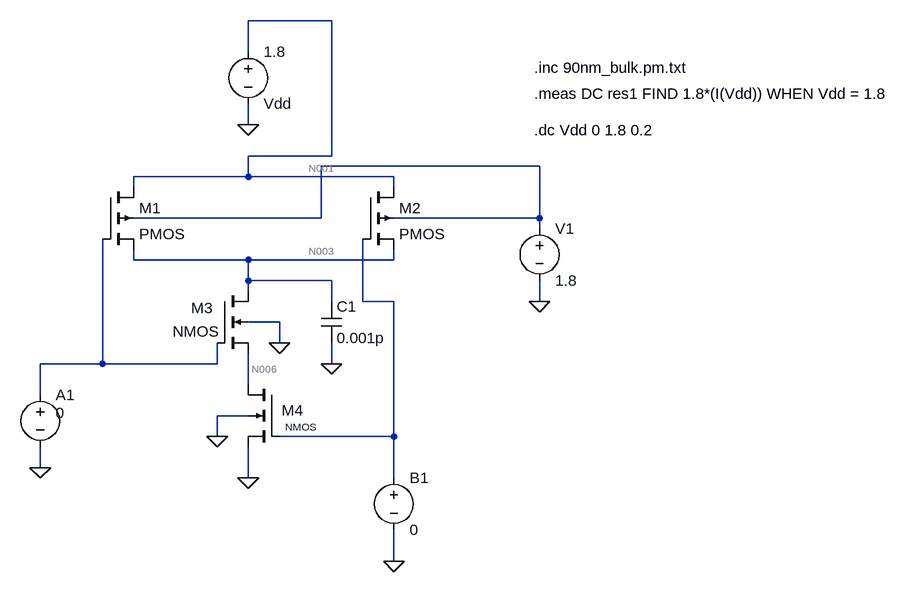
[diagram p0: schematic Draft1.asc]
Draft1.asc, the LTspice schematic file:
Version 4
SHEET 1 1124 680
WIRE 192 -608 64 -608
WIRE 64 -560 64 -608
WIRE 64 -448 64 -480
WIRE 192 -400 192 -608
WIRE 192 -400 64 -400
WIRE 512 -384 176 -384
WIRE 64 -368 64 -400
WIRE 64 -368 -112 -368
WIRE 288 -368 64 -368
WIRE -112 -352 -112 -368
WIRE 288 -352 288 -368
WIRE 176 -304 176 -384
WIRE 176 -304 -112 -304
WIRE 512 -304 512 -384
WIRE 512 -304 288 -304
WIRE 512 -288 512 -304
WIRE -112 -240 -112 -256
WIRE 64 -240 -112 -240
WIRE 288 -240 288 -256
WIRE 288 -240 64 -240
WIRE 64 -208 64 -240
WIRE 192 -208 64 -208
WIRE 64 -192 64 -208
WIRE 192 -176 192 -208
WIRE 240 -176 240 -272
WIRE 288 -176 240 -176
WIRE 512 -176 512 -208
WIRE 112 -144 64 -144
WIRE 112 -112 112 -144
WIRE -160 -80 -160 -272
WIRE -160 -80 -256 -80
WIRE 16 -80 16 -112
WIRE 16 -80 -160 -80
WIRE 192 -80 192 -112
WIRE 64 -48 64 -96
WIRE -256 -32 -256 -80
WIRE 64 0 16 0
WIRE 16 32 16 0
WIRE 288 32 288 -176
WIRE 288 32 112 32
WIRE -256 80 -256 48
WIRE 64 96 64 48
WIRE 288 96 288 32
WIRE 288 224 288 176
FLAG 192 -80 0
FLAG 64 -448 0
FLAG 112 -112 0
FLAG 64 96 0
FLAG 288 224 0
FLAG 16 32 0
FLAG -256 80 0
FLAG 512 -176 0
SYMBOL voltage 64 -576 R0
WINDOW 0 24 96 Left 2
WINDOW 3 24 16 Left 2
WINDOW 123 0 0 Left 0
WINDOW 39 0 0 Left 0
SYMATTR InstName Vdd
SYMATTR Value 1.8
SYMBOL pmos4 -160 -352 R0
SYMATTR InstName M1
SYMATTR Value2 l=90n w=400n
SYMBOL pmos4 240 -352 R0
SYMATTR InstName M2
SYMATTR Value2 l=90n w=400n
SYMBOL nmos4 16 -192 R0
WINDOW 0 -40 26 Left 2
WINDOW 3 -68 62 Left 2
SYMATTR InstName M3
SYMATTR Value2 l=90n w=100n
SYMBOL nmos4 112 -48 M0
WINDOW 0 -20 40 Center 2
WINDOW 3 -33 55 Top 1
SYMATTR InstName M4
SYMATTR Value2 l=90n w=100n
SYMBOL cap 176 -176 R0
SYMATTR InstName C1
SYMATTR Value 0.001p
SYMBOL voltage 288 80 R0
WINDOW 123 0 0 Left 0
WINDOW 39 0 0 Left 0
SYMATTR InstName B1
SYMATTR Value 0
SYMBOL voltage -256 -48 R0
WINDOW 3 24 44 Left 2
WINDOW 123 0 0 Left 0
WINDOW 39 0 0 Left 0
SYMATTR InstName A1
SYMATTR Value 0
SYMBOL voltage 512 -304 R0
WINDOW 123 0 0 Left 0
WINDOW 39 0 0 Left 0
SYMATTR InstName V1
SYMATTR Value 1.8
TEXT 504 -536 Left 2 !.inc 90nm_bulk.pm.txt
TEXT 504 -496 Left 2 !.meas DC res1 FIND 1.8*(I(Vdd)) WHEN Vdd = 1.8
TEXT 504 -440 Left 2 !.dc Vdd 0 1.8 0.2

The netlist it stands for:
* Draft1.asc
Vdd N001 0 1.8
M1 N001 N005 N003 N002 PMOS l=90n w=400n
M2 N001 N004 N003 N002 PMOS l=90n w=400n
M3 N003 N005 N006 0 NMOS l=90n w=100n
M4 N006 N004 0 0 NMOS l=90n w=100n
C1 N003 0 0.001p
V§B1 N004 0 0
V§A1 N005 0 0
V1 N002 0 1.8
.model NMOS NMOS
.model PMOS PMOS
.lib standard.mos
.inc 90nm_bulk.pm.txt
.meas DC res1 FIND 1.8*(I(Vdd)) WHEN Vdd = 1.8
.dc Vdd 0 1.8 0.2
.backanno
.end

* Results of the author's LTspice run, read from the files saved beside the schematic
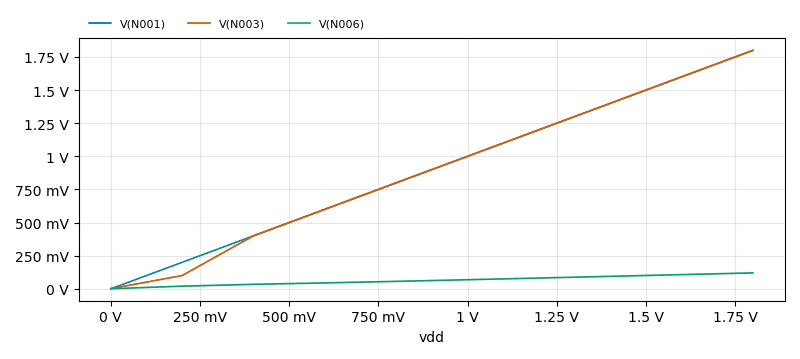
[diagram p1: DC transfer characteristic of Draft1.asc, plotted from the saved traces]
* DC transfer characteristic, 1 run:
*   V(N001): 0 V at vdd=0 V, 1.8 V at vdd=1.8 V, min 0 V, max 1.8 V
*   V(N003): 1.023 mV at vdd=0 V, 1.8 V at vdd=1.8 V, min 1.023 mV, max 1.8 V
*   V(N006): 507.1 µV at vdd=0 V, 120.1 mV at vdd=1.8 V, min 507.1 µV, max 120.1 mV
* From the log:
*   res1: 1.8*(i(vdd))=-2.5974e-008 at 1.8